# Altium schematic sheet JTAG.SchDoc
size A3; Organization: ICNS, MARCS Institute; Address1: Werrington South Campus, Great Western Highway; Address2: Werrington, NSW, 2747; SheetNumber: 13; SheetTotal: 16
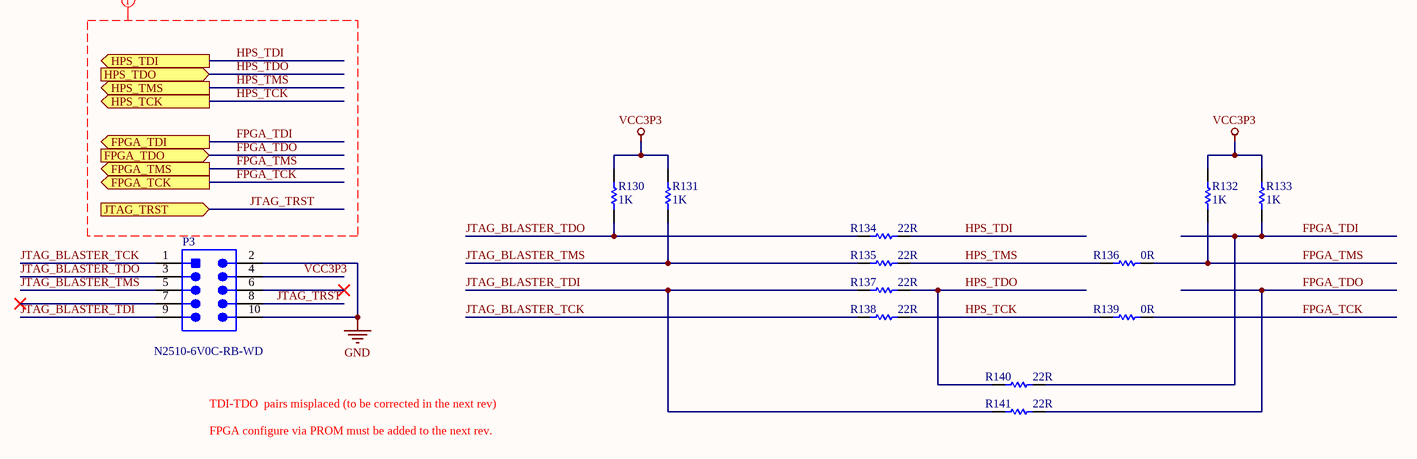
[diagram p0: JTAG.SchDoc]

## Parts
P3  N2510-6V0C-RB-WD  [3M_N2510-6V0C-RB-WD]
R130  value 1K  [RES 0201 (0603)]  (hidden comment: AC0201FR-071KL)
R131  value 1K  [RES 0201 (0603)]  (hidden comment: AC0201FR-071KL)
R132  value 1K  [RES 0201 (0603)]  (hidden comment: AC0201FR-071KL)
R133  value 1K  [RES 0201 (0603)]  (hidden comment: AC0201FR-071KL)
R134  value 22R  [RES 0201 (0603)]  (hidden comment: AC0201FR-0722RL)
R135  value 22R  [RES 0201 (0603)]  (hidden comment: AC0201FR-0722RL)
R136  value 0R  [RES 0201 (0603)]  (hidden comment: AF0201JR-070RL)
R137  value 22R  [RES 0201 (0603)]  (hidden comment: AC0201FR-0722RL)
R138  value 22R  [RES 0201 (0603)]  (hidden comment: AC0201FR-0722RL)
R139  value 0R  [RES 0201 (0603)]  (hidden comment: AF0201JR-070RL)
R140  value 22R  [RES 0201 (0603)]  (hidden comment: AC0201FR-0722RL)
R141  value 22R  [RES 0201 (0603)]  (hidden comment: AC0201FR-0722RL)

## Ports
FPGA_TCK (out), FPGA_TDI (out), FPGA_TDO (in), FPGA_TMS (out), HPS_TCK (out), HPS_TDI (out), HPS_TDO (in), HPS_TMS (out), JTAG_TRST (in)

## Nets
GND: P3.2 P3.10
VCC3P3: P3.4 R130.1 R131.1 R132.1 R133.1
FPGA_TCK: R139.2 ; port FPGA_TCK
FPGA_TDI: R133.2 R140.2 ; port FPGA_TDI
FPGA_TDO: R141.2 ; port FPGA_TDO
FPGA_TMS: R132.2 R136.2 ; port FPGA_TMS
HPS_TCK: R138.2 R139.1 ; port HPS_TCK
HPS_TDI: R134.2 ; port HPS_TDI
HPS_TDO: R137.2 R140.1 ; port HPS_TDO
HPS_TMS: R135.2 R136.1 ; port HPS_TMS
JTAG_BLASTER_TCK: P3.1 R138.1
JTAG_BLASTER_TDI: P3.9 R137.1 R141.1
JTAG_BLASTER_TDO: P3.3 R130.2 R134.1
JTAG_BLASTER_TMS: P3.5 R131.2 R135.1
JTAG_TRST: P3.8 ; port JTAG_TRST

Not connected (* = marked no-connect by the designer): P3 6* 7*

## Layout directives
net class DIGITAL: FPGA_TCK, FPGA_TDI, FPGA_TDO, FPGA_TMS, HPS_TCK, HPS_TDI, HPS_TDO, HPS_TMS, JTAG_TRST

## Notes on the sheet
- TDI-TDO  pairs misplaced (to be corrected in the next rev)
- FPGA configure via PROM must be added to the next rev.
- Drawn by
- Size:
- Date:
- A3
- Checked by
- Sheet
- Revision:
- of

## Library data of the parts
P3 = CMP-010-000004-1: Header, High Temperature, PCB Plug, 10 Cont, Solder Tail, Thru-Hole, 2500 Series, 2A; Manufacturer: 3M; Gender: Male; Pitch: 2.54mm; Number of Positions: 10; Row Spacing: 0.1inch; Max Current Rating: 1.75A; Connector Type: Male Pin; Approvals: UL; Orientation: Straight; Contact Material: Copper Alloy,Gold,Copper; Contact Plating: Gold; Width: 8.59mm; ComponentLink1URL: https://datasheet.ciiva.com/15188/getdatasheetpartid-337561-15188354.pdf?src-supplier=Verical; ComponentLink3URL: https://datasheet.ciiva.com/711/ts0770-711343.pdf?src-supplier=Digi-Key; ComponentLink6Description: https://datasheet.ciiva.com/5151/ts0770-5151727.pdf?src-supplier=Mouser; Flammability Rating: UL94 V-0; Pricing 1: 10=3.13100, 100=2.81700, 250=2.56800, 500=2.41100, 1000=2.22400 (USD); Category: Headers and Wire Housings; Series: 2500; ComponentLink1Description: https://datasheet.ciiva.com/15188/getdatasheetpartid-337561-15188354.pdf?src-supplier=Verical; Length: 20.02mm; ComponentLink7URL: https://datasheet.ciiva.com/14641/70114325-14641384.pdf?src-supplier=Allied+Electronics; Color: Black; ComponentLink4URL: https://datasheet.ciiva.com/711/ts0770-711344.pdf?src-supplier=Digi-Key; ComponentLink5Description: https://datasheet.ciiva.com/728/ts0770-728860.pdf?src-supplier=Digi-Key; REACH SVHC: No SVHC; Min Operating Temperature: -55°C; Mount: Surface Mount; Contact Type: Male Pin; Max Operating Temperature: 105°C; Packaging: Tape and Reel; Contact Gender: Male; Current Rating: 2A; ComponentLink4Description: https://datasheet.ciiva.com/711/ts0770-711344.pdf?src-supplier=Digi-Key; RoHS Compliant: Yes; Number of Contacts: 10; ComponentLink2URL: https://datasheet.ciiva.com/11750/0900766b80934f0f-11750746.pdf?src-supplier=RSComponents; ComponentLink5URL: https://datasheet.ciiva.com/728/ts0770-728860.pdf?src-supplier=Digi-Key; Design Item ID: N2510-6V0C-RB-WD; Source: ICNS_PropheseeLib.SchLib; ComponentLink2Description: https://datasheet.ciiva.com/11750/0900766b80934f0f-11750746.pdf?src-supplier=RSComponents; RoHS: Yes; ComponentLink3Description: https://datasheet.ciiva.com/711/ts0770-711343.pdf?src-supplier=Digi-Key; Housing Material: Polyester; Depth: 8.59mm; Termination: Solder; ComponentLink7Description: https://datasheet.ciiva.com/14641/70114325-14641384.pdf?src-supplier=Allied+Electronics; Number of Rows: 2; Stock 1: 1; Contact Mating Length: 0.243inch; Lead Free: Lead Free; Manufacturer Part Number: N2510-6V0C-RB-WD; ComponentLink6URL: https://datasheet.ciiva.com/5151/ts0770-5151727.pdf?src-supplier=Mouser; Package Quantity: 1; Housing Color: Black
R130-R133 = CMP-006-000019-1: Res Thick Film 0201 1K Ohm 1% 0.05W(1/20W) ±200ppm/C Pad SMD Automotive T/R; Manufacturer: Yageo; Max Power Dissipation: 50mW; Temperature Coefficient: 200ppm/°C; Resistance: 1kR; RoHS: Yes; Case/Package: 0201; Case Code (Metric): 0603; Case Code (Imperial): 0201; Min Operating Temperature: -55°C; Max Operating Temperature: 155°C; Tolerance: 1%; Number of Terminations: 2; Width: 0.012inch; ComponentLink1URL: http://www.yageo.com/NewPortal/yageodocoutput?fileName=/pdf/R-Chip/PYu-AC_51_RoHS_L_6.pdf&src-supplier=Digi-Key; ComponentLink1Description: http://www.yageo.com/NewPortal/yageodocoutput?fileName=/pdf/R-Chip/PYu-AC_51_RoHS_L_6.pdf&src-supplier=Digi-Key; Stock 1: 200; Pricing 1: 1=0.10000, 10=0.06600, 100=0.02670, 1000=0.01201, 2500=0.01042, 5000=0.00861 (USD); Features: Moisture Resistant,Automotive AEC-Q200; Packaging: Tape and Reel; Length: 0.024inch; Height: 0.01inch; Source: ICNS_PropheseeLib.SchLib; Manufacturer Part Number: AC0201FR-071KL; Resistor Type: Thick Film; Category: Chip SMD Resistors; Design Item ID: AC0201FR-071KL
R134 R135 R137 R138 R140 R141 = CMP-006-000052-2: Res Thick Film 0201 22 Ohm 1% 0.05W(1/20W) ±200ppm/C Pad SMD Automotive T/R; Manufacturer: Yageo; Max Power Dissipation: 50mW; Temperature Coefficient: 200ppm/°C; Power Rating: 100mW; Voltage Rating (DC): 50V; RoHS: Yes; Case/Package: 0201; Case Code (Metric): 0603; Case Code (Imperial): 0201; Min Operating Temperature: -55°C; Max Operating Temperature: 155°C; Tolerance: 1%; Number of Terminations: 2; Width: 0.012inch; ComponentLink1URL: https://datasheet.ciiva.com/11819/0900766b80f96399-11819285.pdf?src-supplier=RSComponents; ComponentLink1Description: https://datasheet.ciiva.com/11819/0900766b80f96399-11819285.pdf?src-supplier=RSComponents; ComponentLink2URL: https://datasheet.ciiva.com/2454/pyu-r-int-thick-7-2454354.pdf?src-supplier=Digi-Key; ComponentLink2Description: https://datasheet.ciiva.com/2454/pyu-r-int-thick-7-2454354.pdf?src-supplier=Digi-Key; ComponentLink3URL: https://datasheet.ciiva.com/2454/pyu-r-int-thick-7-2454355.pdf?src-supplier=Digi-Key; ComponentLink3Description: https://datasheet.ciiva.com/2454/pyu-r-int-thick-7-2454355.pdf?src-supplier=Digi-Key; Stock 1: 375294; Pricing 1: 5000=0.00312 (USD); Features: Moisture Resistant,Automotive AEC-Q200; Military Standard: Not; Termination: SMD/SMT; Package Quantity: 1; Resistance: 22R; Packaging: Cut Tape; Length: 0.024inch; Height: 0.01inch; Depth: 0.8mm; Lead Free: Lead Free; ComponentLink4URL: https://datasheet.ciiva.com/2454/pyu-r-int-thick-7-2454356.pdf?src-supplier=Digi-Key; ComponentLink4Description: https://datasheet.ciiva.com/2454/pyu-r-int-thick-7-2454356.pdf?src-supplier=Digi-Key; Series: AC; ComponentLink6URL: https://datasheet.ciiva.com/46440/1868787-46440901.pdf?src-supplier=Element14; REACH SVHC: No SVHC; ComponentLink5Description: https://datasheet.ciiva.com/46395/443971-46395032.pdf?src-supplier=Element14; Source: ICNS_PropheseeLib.SchLib; Technology: THICK FILM; ComponentLink5URL: https://datasheet.ciiva.com/46395/443971-46395032.pdf?src-supplier=Element14; Resistor Type: Thick Film; Voltage Rating: 50V; Size Code: 0603; ComponentLink6Description: https://datasheet.ciiva.com/46440/1868787-46440901.pdf?src-supplier=Element14; RoHS Compliant: Yes; Number of Pins: 2; Resistance Tolerance: 1%; Category: Chip SMD Resistors; Construction: Rectangular
R136 R139 = CMP-006-000020-1: Res Thick Film 0201 0 Ohm Sulfur Resistant Pad SMD Automotive T/R; Manufacturer: Yageo; Max Power Dissipation: 50mW; Resistance: 0mR; RoHS: Yes; Case/Package: 0201; Case Code (Metric): 0603; Case Code (Imperial): 0201; Min Operating Temperature: -55°C; Max Operating Temperature: 125°C; Number of Terminations: 2; Width: 0.012inch; ComponentLink1URL: http://www.mouser.com/ds/2/447/PYu-AF_51_RoHS_L_5-1085711.pdf?src-supplier=Mouser; ComponentLink1Description: http://www.mouser.com/ds/2/447/PYu-AF_51_RoHS_L_5-1085711.pdf?src-supplier=Mouser; ComponentLink2URL: http://www.yageo.com/documents/recent/PYu-AF_51_RoHS_L_5.pdf?src-supplier=Digi-Key; ComponentLink2Description: http://www.yageo.com/documents/recent/PYu-AF_51_RoHS_L_5.pdf?src-supplier=Digi-Key; Stock 1: 50009; Pricing 1: 1=0.11000, 10=0.09500, 25=0.06560, 50=0.05100, 100=0.03640, 250=0.02840, 500=0.02256, 1000=0.01602, 5000=0.01238 (USD); Features: Moisture Resistant,Anti-Sulfur; Termination: SMD/SMT; Package Quantity: 10000; Packaging: Tape and Reel; Length: 0.024inch; Height: 0.01inch; Design Item ID: AF0201JR-070RL; Weight: 6E-06oz; RoHS Compliant: Yes; Resistor Type: Thick Film; Source: ICNS_PropheseeLib.SchLib; Manufacturer Part Number: AF0201JR-070RL; Category: Chip SMD Resistors